# EAGLE design output (EAGLE 5.10)
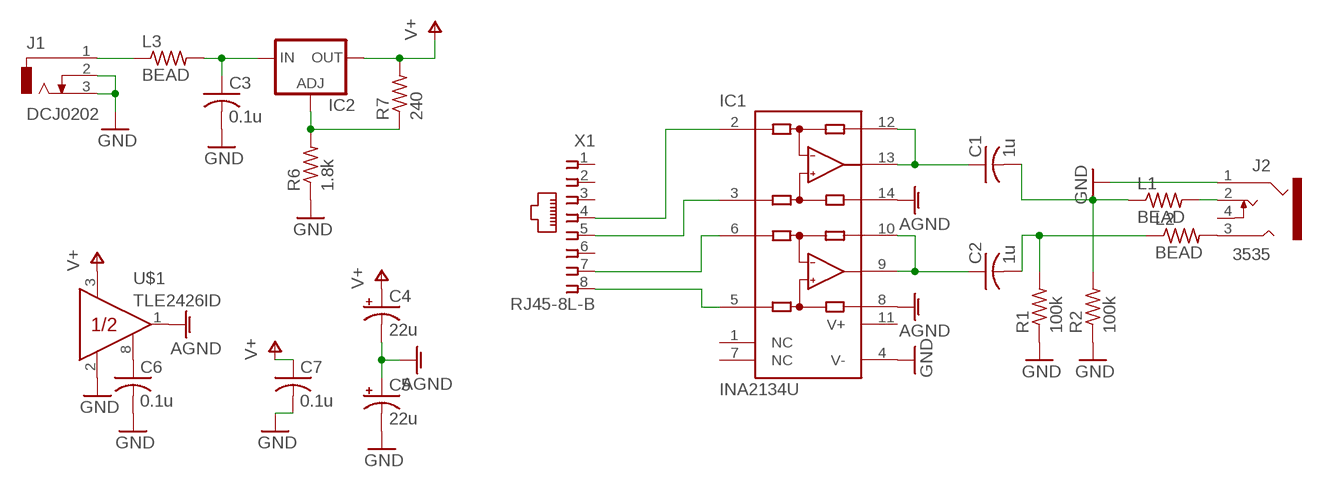
[diagram p0: schematic, sheet 1]

## Parts
C1  1u  C-USC1210  [C1210]
C2  1u  C-USC1210  [C1210]
C3  0.1u  C-USC0805  [C0805]
C4  22u  CPOL-USE2-5  [E2-5]
C5  22u  CPOL-USE2-5  [E2-5]
C6  0.1u  C-USC0805  [C0805]
C7  0.1u  C-USC0805  [C0805]
IC1  INA2134U  [SO14]
IC2  LM317TS  [317TS]
J1  DCJ0202  [DCJ0202]
J2  3535  [3535]
L1  BEAD  R-US_R1206  [R1206]
L2  BEAD  R-US_R1206  [R1206]
L3  BEAD  R-US_R1206  [R1206]
R1  100k  R-US_R0805  [R0805]
R2  100k  R-US_R0805  [R0805]
R6  1.8k  R-US_R0805  [R0805]
R7  240  R-US_R0805  [R0805]
U$1  TLE2426ID  [SO-8]
X1  RJ45-8L-B  [RJ45-NO-SHIELD]

## Nets
AGND: C4.- C5.+ IC1.8(REFB) IC1.14(REFA) U$1.1(OUT)
GND: C3.2 C5.- C6.2 C7.2 IC1.4(V-) J1.2 J1.3 J2.1 R1.1 R2.1 R6.1 U$1.2(COM)
N$1: IC1.2(-INA) X1.4
N$2: IC1.3(+INA) X1.5
N$3: IC1.6(-INB) X1.7
N$4: IC1.5(+INB) X1.8
N$5: C1.2 L1.1 R2.2
N$6: C2.2 L2.1 R1.2
N$7: C2.1 IC1.9(OUTB) IC1.10(SENSEB)
N$8: C1.1 IC1.12(SENSEA) IC1.13(OUTA)
N$9: J2.3 L2.2
N$10: J2.2 L1.2
N$11: J1.1 L3.1
N$12: C3.1 IC2.3(IN) L3.2
N$13: IC2.1(ADJ) R6.2 R7.1
N$15: C6.1 U$1.8(NR)
V+: C4.+ C7.1 IC2.2(OUT) R7.2 U$1.3(IN)
Unconnected: IC1.1(NC) IC1.7(NC) J2.4(3.S) X1.1 X1.2 X1.3 X1.6

## Power pins joined to a net without a drawn wire
V+: IC1.11(V+)

## Library data of the parts
C1-C3 C6 C7 = rcl:C-US: CAPACITOR, American symbol
C4 C5 = rcl:CPOL-US: POLARIZED CAPACITOR, American symbol
IC1 = burr-brown:INA2134: Audio Differential Line Receivers 0dB, G=1
IC2 = v-reg:LM317TS: VOLTAGE REGULATOR
J1 = con-jack:DCJ0202: DC POWER JACK Source: DCJ0202.pdf
J2 = amp:3535
L1-L3 R1 R2 R6 R7 = rcl:R-US_: RESISTOR, American symbol
U$1 = tle2426:TLE2426*: Texas Instruments "rail splitter" with noise-reduction
X1 = con-tycoelectronics:RJ45: CORCOM Modular RJ Jacks No Shield Source: www.tycoelectronics.com .. ENG_DS_1654001_1099_RJ_L_0507.pdf

## Board
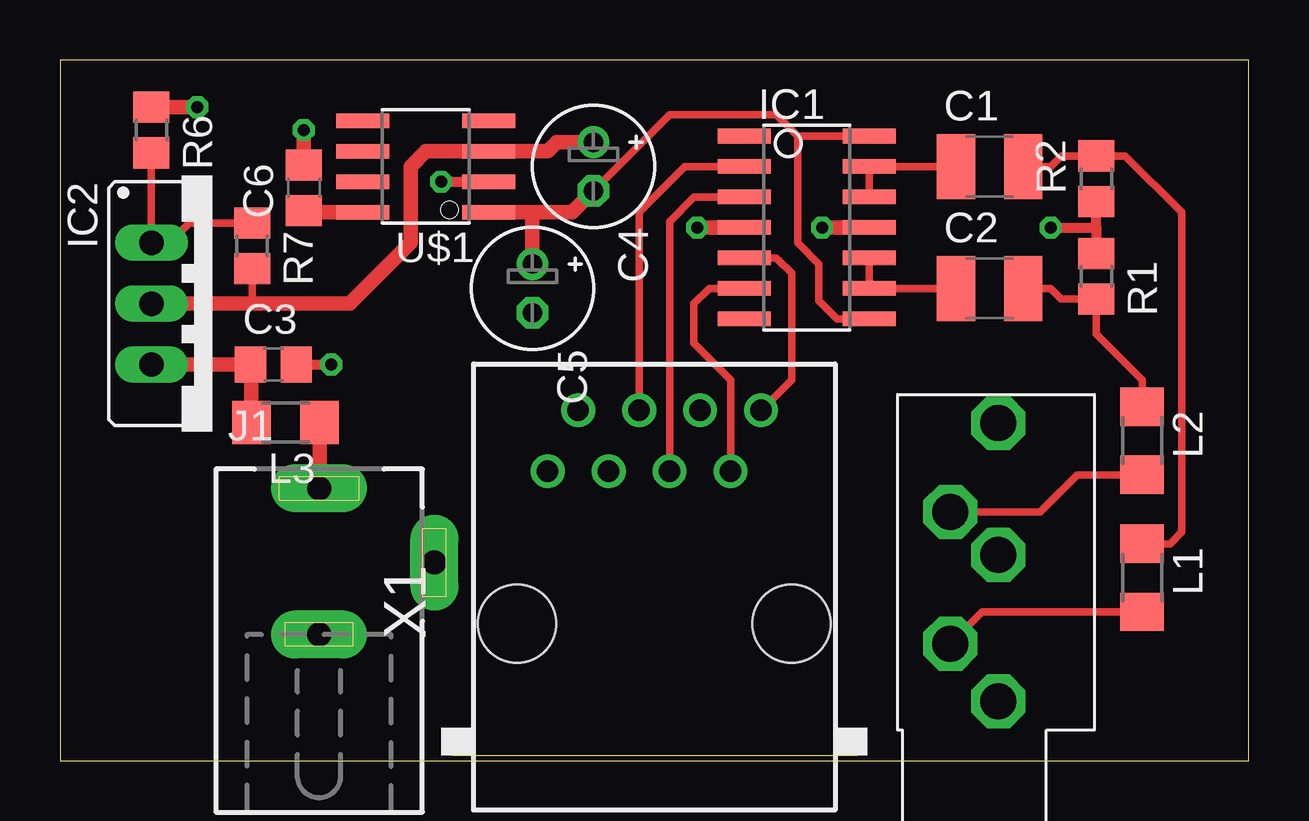
[diagram p1: board, top side]
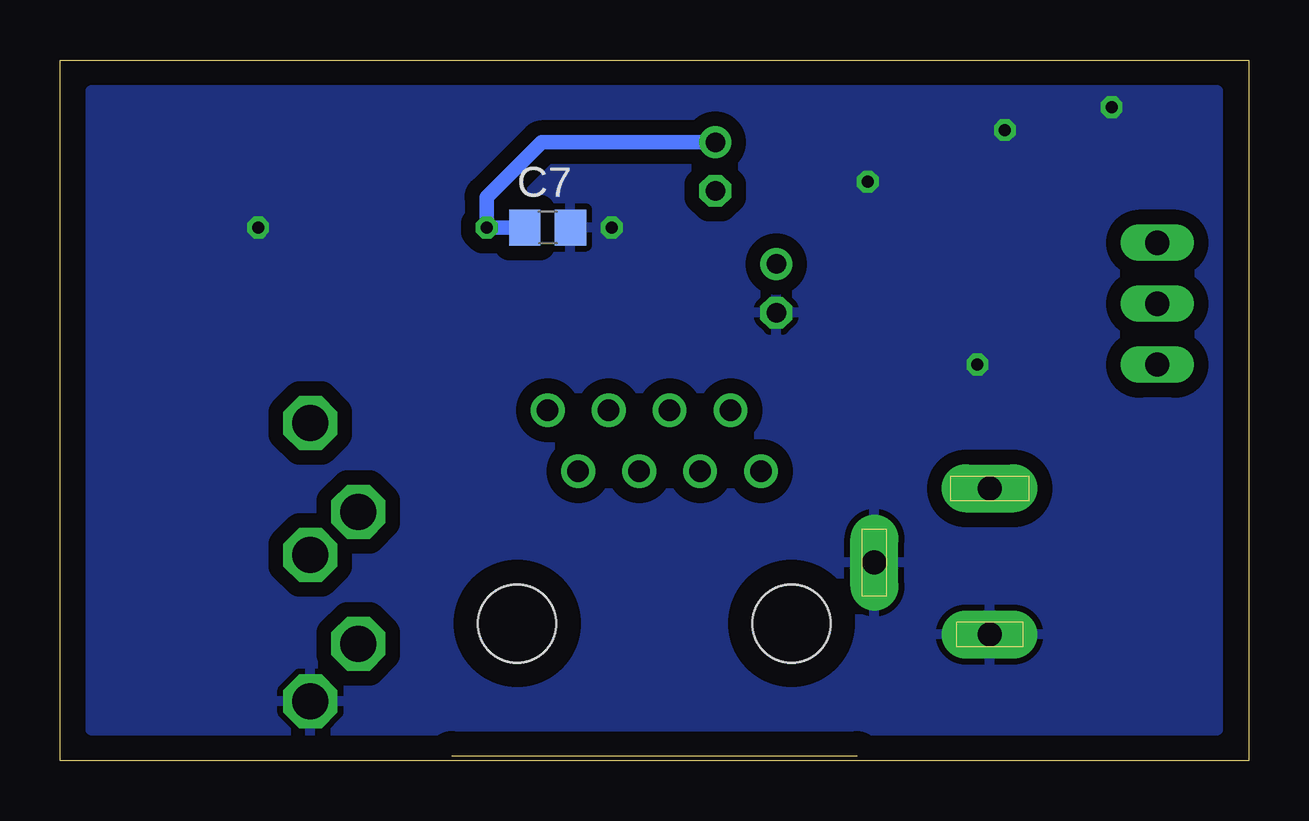
[diagram p2: board, bottom side, seen from below]

Size 49.53 x 29.21 mm. Coordinates in mm from the lower left corner, seen from the top.
Outline: 49.53,0 49.53,29.21 0,29.21 0,0 49.53,0
Copper layers (1*16): Top 0.035mm / dielectric 1.5mm / Bottom 0.035mm
Design rules "default *": minimum track width 10mil, minimum drill 18mil, track to track 10mil, track to pad 10mil, pad to pad 10mil, via to via 10mil, smd to smd 10mil, copper to edge 40mil, drill to drill 8mil, minimum pad ring 10mil, minimum via ring 8mil, stop-mask expansion 4mil, vias tented up to drill 0mil, thermal gap 10mil

### Footprints (pad centres in the part's own frame; a part is rotated, then mirrored left to right if it is on the bottom)
C1210 = smd 1.6 x 2.7: 1 -1.4,0; 2 1.4,0
C0805 = smd 1.3 x 1.5: 1 -0.95,0; 2 0.95,0
E2-5 = drill 0.813 pad 1.27 round: + -1.016,0 | drill 0.813 pad 1.27 octagon: - 1.016,0
SO14 = smd 0.61 x 2.21: 1 -3.81,-2.603; 2 -2.54,-2.603; 3 -1.27,-2.603; 4 0,-2.603; 5 1.27,-2.603; 6 2.54,-2.603; 7 3.81,-2.603; 8 3.81,2.603; 9 2.54,2.603; 10 1.27,2.603; 11 0,2.603; 12 -1.27,2.603; 13 -2.54,2.603; 14 -3.81,2.603
317TS = drill 1.016 long: 1 -2.54,-2.54; 2 0,-2.54; 3 2.54,-2.54
DCJ0202 = drill 1 pad 2 long: 1 0,3.1; 2 4.8,0; 3 0,-3
3535 = drill 1.5 pad 2.184 octagon: 1 1.2,-1; 2 3.6,1; 3 9.1,1; 4 12.8,-1; 5 7.3,-1
R1206 = smd 1.6 x 1.803: 1 -1.422,0; 2 1.422,0
R0805 = smd 1.3 x 1.5: 1 -0.95,0; 2 0.95,0
SO-8 = smd 0.61 x 2.21: 1 -1.905,-2.616; 2 -0.635,-2.616; 3 0.635,-2.616; 4 1.905,-2.616; 5 1.905,2.616; 6 0.635,2.616; 7 -0.635,2.616; 8 -1.905,2.616
RJ45-NO-SHIELD = drill 0.9 pad 1.4 round: 1 -4.445,6.35; 2 -3.175,8.89; 3 -1.905,6.35; 4 -0.635,8.89; 5 0.635,6.35; 6 1.905,8.89; 7 3.175,6.35; 8 4.445,8.89 | hole 3.251: -5.715,0; 5.715,0

### Placement (x,y rotation side)
C1  38.73,24.77 0 top
C2  38.73,19.68 0 top
C3  8.89,16.51 0 top
C4  22.23,24.77 270 top
C5  19.68,19.68 270 top
C6  10.16,23.88 90 top
C7  29.21,22.23 0 bottom
IC1  31.11,22.23 270 top
IC2  6.35,19.05 270 top
J1  10.79,8.26 0 top
J2  38.1,1.27 90 top
L1  45.09,7.62 270 top
L2  45.09,13.34 270 top
L3  9.4,14.1 180 top
R1  43.18,20.19 270 top
R2  43.18,24.26 90 top
R6  3.81,26.29 270 top
R7  8,21.46 270 top
U$1  15.24,24.77 90 top
X1  24.77,5.71 0 top

### Tracks (layer width: path | path; a pad name or v marks a point on that pad's centre or on a via)
AGND
  Top 0.305: 30.73,26.04 IC1.14 | 30.73,26.04 29.84,26.92 25.4,26.92 C4.- | 30.73,26.04 30.73,21.59 31.62,20.7 31.62,19.18 32.38,18.41 IC1.8
  Top 0.61: 19.68,22.86 U$1.1 | C5.+ 19.68,22.86 | C4.- 21.34,22.86 19.68,22.86
GND  (via drill 0.5)
  Top 0.406: 43.18,22.23 R2.1 | 43.18,22.23 R1.1 | v41.27,22.23 43.18,22.23 | v15.88,24.13 U$1.2 | C3.2 v11.3,16.51
  Top 0.61: v26.54,22.23 IC1.4 | C6.2 v10.16,26.29 | R6.1 v5.71,27.24
  pour Bottom (isolate 0.61): 1.27,27.94 48.26,27.94 48.26,1.27 1.27,1.27
N$1
  Top 0.305: IC1.2 26.04,24.77 24.13,22.86 X1.4
N$2
  Top 0.305: IC1.3 26.42,23.5 25.4,22.48 X1.5
N$3
  Top 0.305: X1.7 27.94,15.88 26.42,17.4 26.42,19.05 27.05,19.68 IC1.6
N$4
  Top 0.305: X1.8 30.48,15.88 30.48,20.32 29.84,20.95 IC1.5
N$5
  Top 0.305: C1.2 41.27,24.77 41.72,25.21 R2.2 44.39,25.21 46.74,22.86 46.74,9.53 46.25,9.04 L1.1
N$6
  Top 0.305: C2.2 41.27,19.68 41.72,19.24 R1.2 43.18,17.78 45.09,15.88 L2.1
N$7
  Top 0.305: IC1.10 IC1.9 C2.1
N$8
  Top 0.305: IC1.12 IC1.13 C1.1
N$9
  Top 0.305: J2.3 40.85,10.37 42.39,11.91 L2.2
N$10
  Top 0.305: L1.2 38.43,6.2 J2.2
N$11
  Top 0.61: L3.1 10.82,11.36 J1.1
N$12
  Top 0.61: IC2.3 C3.1 7.98,16.51 L3.2
N$13
  Top 0.305: R7.1 5.39,22.41 4.57,21.59 IC2.1 R6.2
N$15
  Top 0.61: C6.1 10.16,22.86 U$1.8
V+  (via drill 0.5)
  Top 0.305: 8,19.05 R7.2
  Top 0.61: IC2.2 8,19.05 12.06,19.05 14.61,21.59 14.61,24.77 15.24,25.4 U$1.3 20.32,25.4 20.7,25.78 C4.+ | v31.75,22.23 IC1.11
  Bottom 0.61: C7.1 v31.75,22.23 31.75,23.5 29.46,25.78 C4.+